# Altium schematic sheet TopLevelSchem.SchDoc
size Letter; DrawnBy: Adam Gilbert; Organization: Altium Limited; Address1: L3, 12a Rodborough Rd; Address2: Frenchs Forest; Address3: NSW; Address4: Australia 2086; DocumentNumber: 1; SheetNumber: 1; SheetTotal: 4
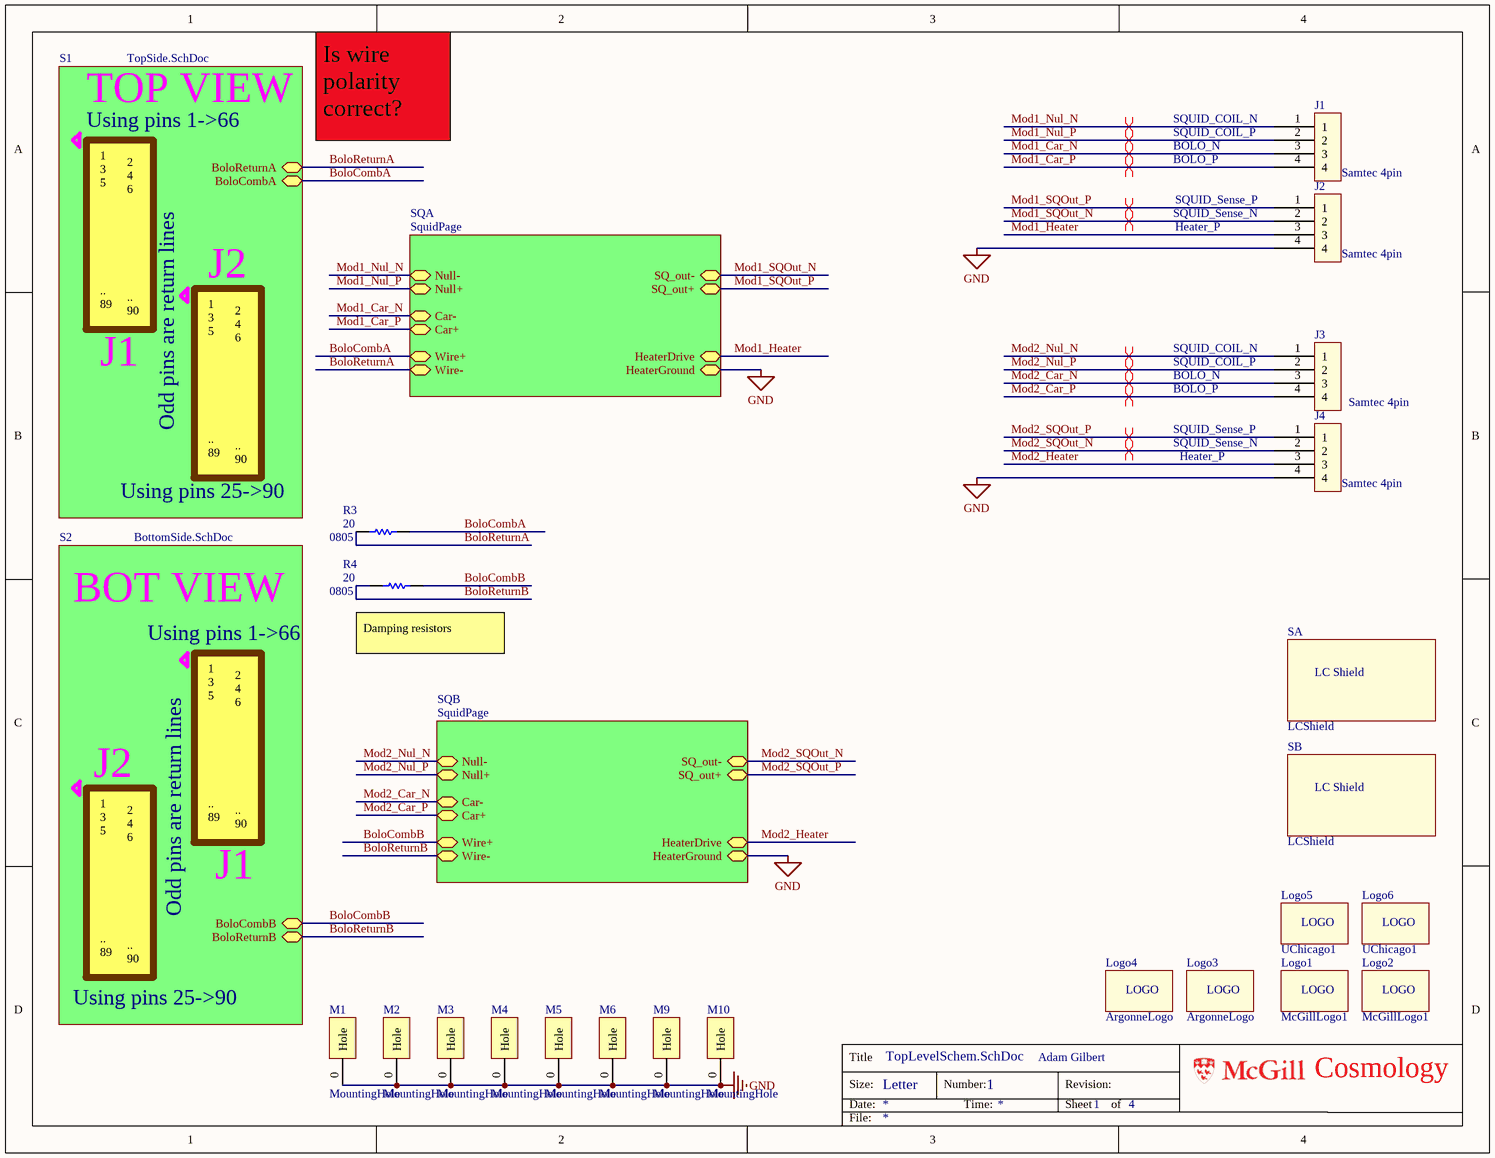
[diagram p0: TopLevelSchem.SchDoc]

## Parts
J1  Samtec 4pin  [Samtec4pin]
J2  Samtec 4pin  [Samtec4pin]
J3  Samtec 4pin  [Samtec4pin]
J4  Samtec 4pin  [Samtec4pin]
Logo1  McGillLogo1  [McGillLogo1]  (no BOM)
Logo2  McGillLogo1  [McGillLogo1]  (no BOM)
Logo3  ArgonneLogo  [ArgonneLogo]  (no BOM)
Logo4  ArgonneLogo  [ArgonneLogo]  (no BOM)
Logo5  UChicago1  [UChicagoLogo]  (no BOM)
Logo6  UChicago1  [UChicagoLogo]  (no BOM)
M1  MountingHole  [MountingHole]  (no BOM)
M2  MountingHole  [MountingHole]  (no BOM)
M3  MountingHole  [MountingHole]  (no BOM)
M4  MountingHole  [MountingHole]  (no BOM)
M5  MountingHole  [MountingHole]  (no BOM)
M6  MountingHole  [MountingHole]  (no BOM)
M9  MountingHole  [MountingHole]  (no BOM)
M10  MountingHole  [MountingHole]  (no BOM)
R3  20  [0805]
R4  20  [0805]
SA  LCShield  [LCShield]
SB  LCShield  [LCShield]

## Sub-sheets
S1 = TopSide.SchDoc: BoloReturnA, BoloCombA
S2 = BottomSide.SchDoc: BoloCombB, BoloReturnB
SQA = SquidPage: HeaterDrive, Null-, HeaterGround, Car+, Car-, SQ_out+, SQ_out-, Null+, Wire+, Wire-
SQB = SquidPage: HeaterDrive, Null-, HeaterGround, Car+, Car-, SQ_out+, SQ_out-, Null+, Wire+, Wire-

## Nets
GND: J2.4 J4.4 M1.0(Hole) M2.0(Hole) M3.0(Hole) M4.0(Hole) M5.0(Hole) M6.0(Hole) M9.0(Hole) M10.0(Hole) ; sheet SQA/HeaterGround, sheet SQB/HeaterGround
BoloCombA: R3.1 ; sheet S1/BoloCombA, sheet SQA/Wire+
BoloCombB: R4.1 ; sheet S2/BoloCombB, sheet SQB/Wire+
BoloReturnA: R3.2 ; sheet S1/BoloReturnA, sheet SQA/Wire-
BoloReturnB: R4.2 ; sheet S2/BoloReturnB, sheet SQB/Wire-
Mod1_Car_N: J1.3 ; sheet SQA/Car-
Mod1_Car_P: J1.4 ; sheet SQA/Car+
Mod1_Heater: J2.3 ; sheet SQA/HeaterDrive
Mod1_Nul_N: J1.1 ; sheet SQA/Null-
Mod1_Nul_P: J1.2 ; sheet SQA/Null+
Mod1_SQOut_N: J2.2 ; sheet SQA/SQ_out-
Mod1_SQOut_P: J2.1 ; sheet SQA/SQ_out+
Mod2_Car_N: J3.3 ; sheet SQB/Car-
Mod2_Car_P: J3.4 ; sheet SQB/Car+
Mod2_Heater: J4.3 ; sheet SQB/HeaterDrive
Mod2_Nul_N: J3.1 ; sheet SQB/Null-
Mod2_Nul_P: J3.2 ; sheet SQB/Null+
Mod2_SQOut_N: J4.2 ; sheet SQB/SQ_out-
Mod2_SQOut_P: J4.1 ; sheet SQB/SQ_out+

## Layout directives
differential pair: Mod1_Car_N, Mod1_Car_P, Mod1_Nul_N, Mod1_Nul_P, Mod1_SQOut_N, Mod1_SQOut_P, Mod2_Car_N, Mod2_Car_P, Mod2_Nul_N, Mod2_Nul_P, Mod2_SQOut_N, Mod2_SQOut_P

## Notes on the sheet
- TOP VIEW
- Using pins 1->66
- Is wire polarity correct?
- SQUID_COIL_P
- SQUID_COIL_N
- BOLO_P
- BOLO_N
- SQUID_Sense_N
- SQUID_Sense_P
- Heater_P
- J2
- 1
  3
  5
  ..
  89
- J1
- 2
  4
  6
  ..
  90
- Odd pins are return lines
- Using pins 25->90
- BOT VIEW
- (near R4) Damping resistors
- Title
- Size:
- Date:
- Letter
- Number:
- Time:
- Revision:
- Sheet
- of
- Cosmology
- File:
- (in symbol LCShield) LC Shield
- (in symbol Logo) LOGO

## Library data of the parts
J1-J4 = Samtec4pin
Logo1-Logo6 = Logo
R3 R4 = Res1206: Resistor; Param1: 100ppm/C; Value: 50; Param: 1%; TechInfo: *